# Altium schematic sheet MINIMP3.SchDoc
size A3
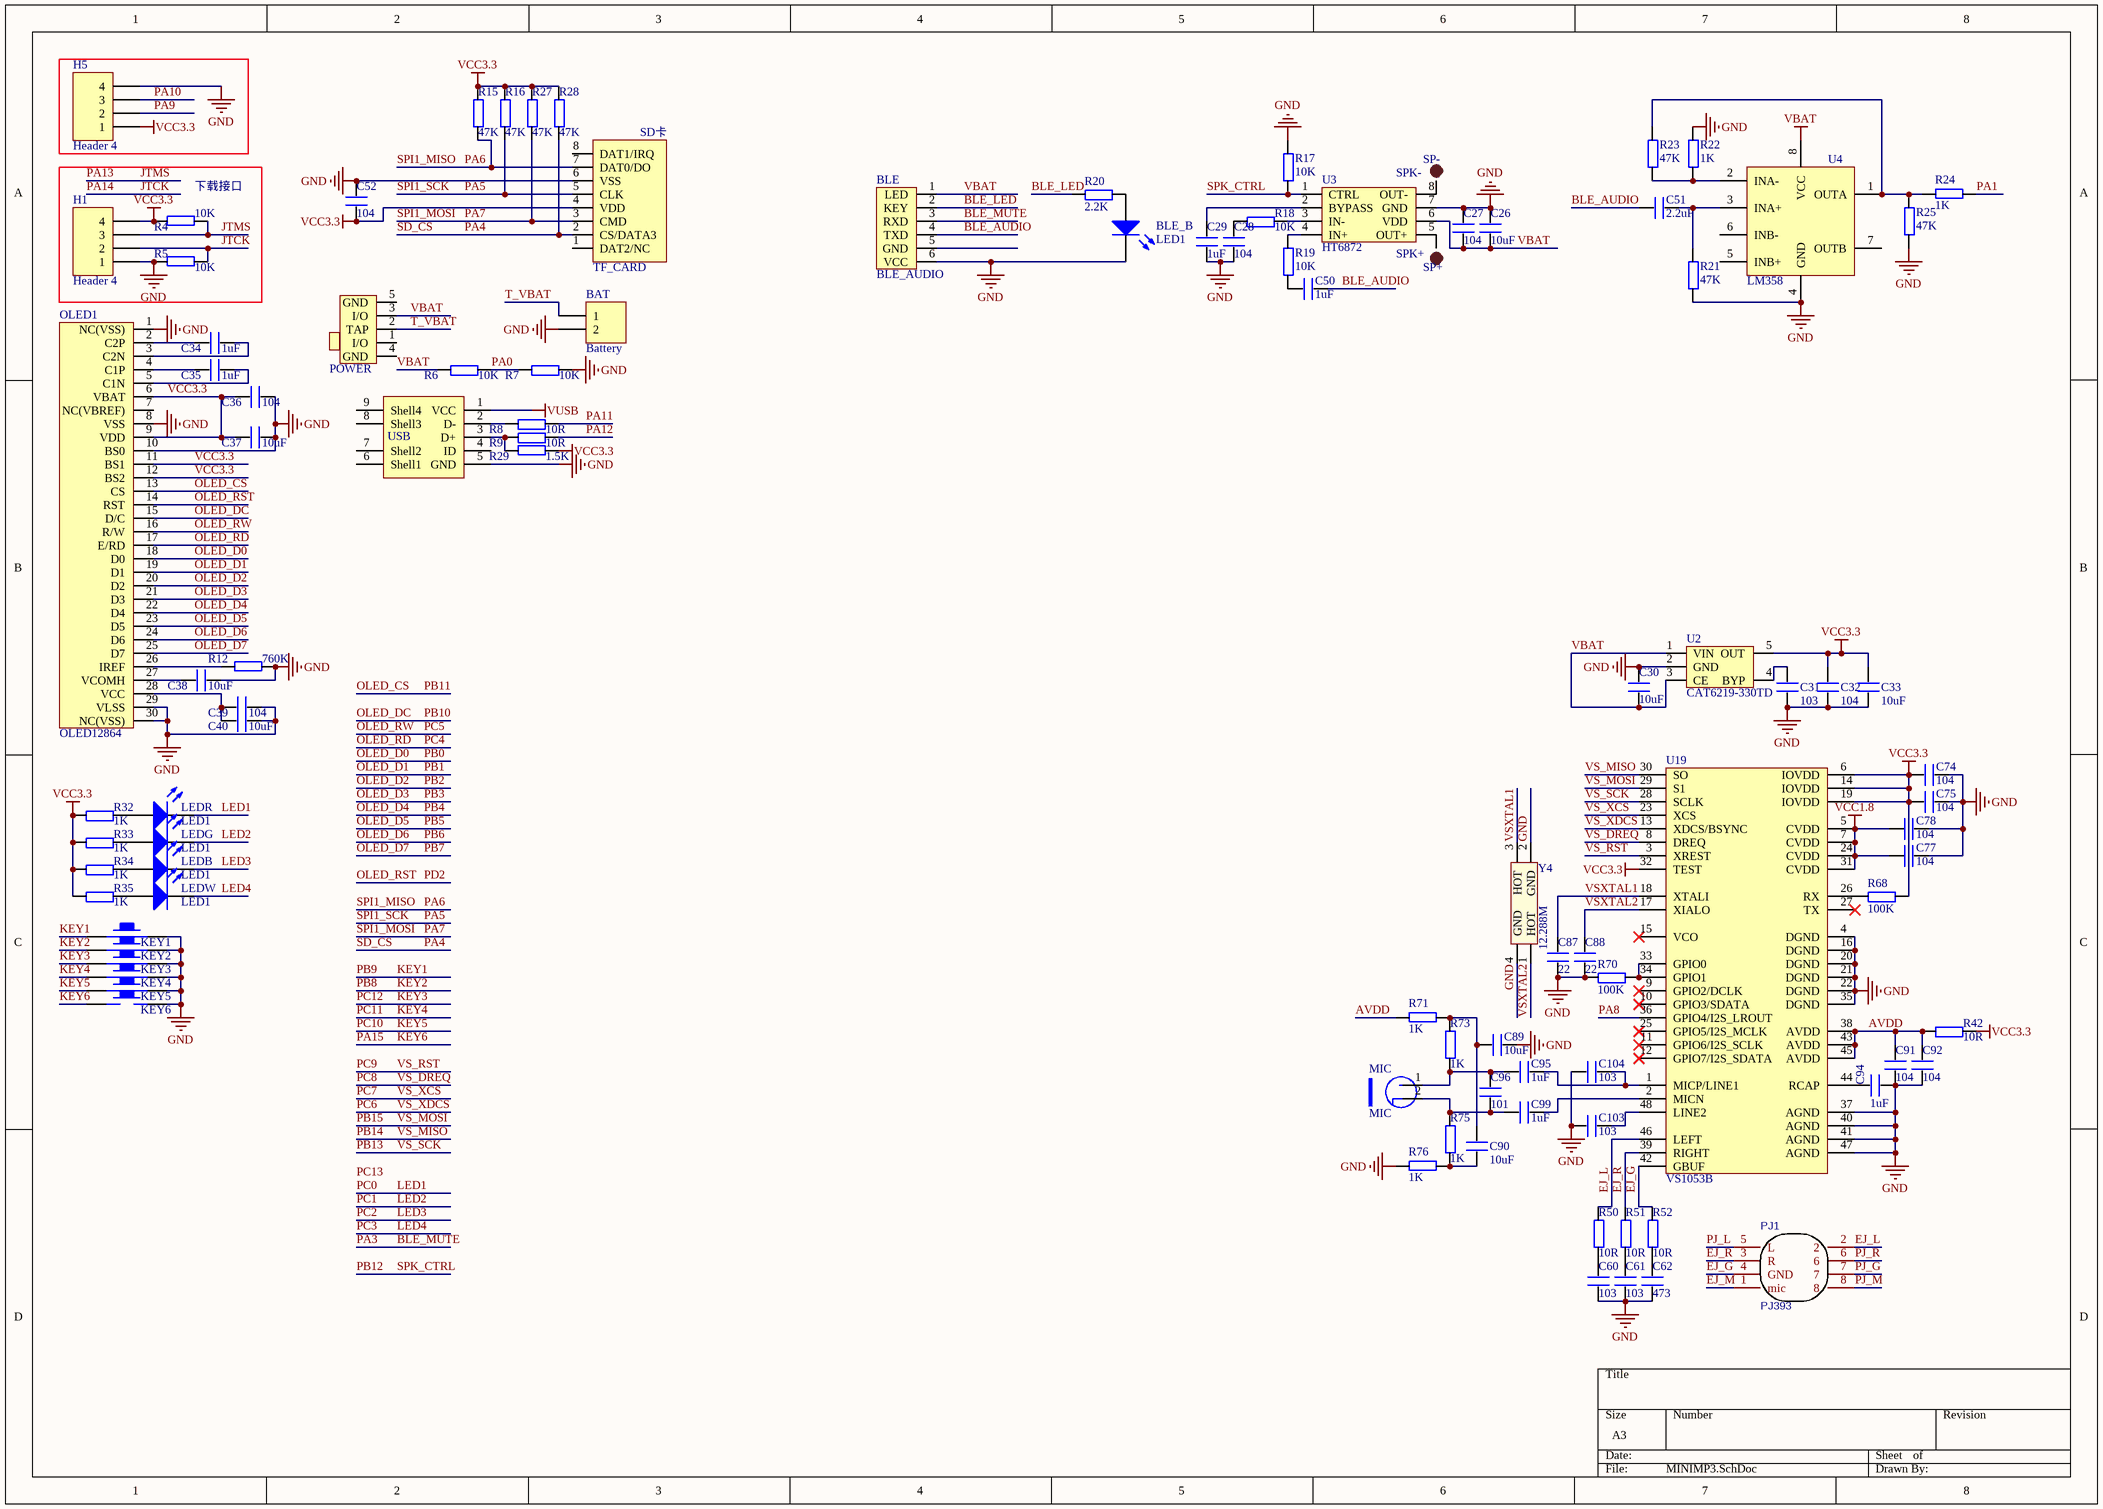
[diagram p0: MINIMP3.SchDoc]

## Parts
BAT  Battery  [HDR2.54-LI-2P]
BLE  BLE_AUDIO  [HEAD6]
BLE_B  LED1  [LED 0805B]
C26  10uF  [C 0603_M]
C27  104  [C 0603_M]
C28  104  [C 0603_M]
C29  1uF  [C 0603_M]
C30  10uF  [C 0603_M]
C31  103  [C 0603_M]
C32  104  [C 0603_M]
C33  10uF  [C 0603_M]
C34  1uF  [C 0603_M]
C35  1uF  [C 0603_M]
C36  104  [C 0603_M]
C37  10uF  [C 0603_M]
C38  10uF  [C 0603_M]
C39  104  [C 0603_M]
C40  10uF  [C 0603_M]
C50  1uF  [C 0603_M]
C51  2.2uF  [C 0603_M]
C52  104  [C 0603_M]
C60  103  [C 0603_M]
C61  103  [C 0603_M]
C62  473  [C 0603_M]
C74  104  [C 0603_M]
C75  104  [C 0603_M]
C77  104  [C 0603_M]
C78  104  [C 0603_M]
C87  22  [C 0603_M]
C88  22  [C 0603_M]
C89  10uF  [C 0805_M]
C90  10uF  [C 0805_M]
C91  104  [C 0603_M]
C92  104  [C 0603_M]
C94  1uF  [C 0603_M]
C95  1uF  [C 0603_M]
C96  101  [C 0603_M]
C99  1uF  [C 0603_M]
C103  103  [C 0603_M]
C104  103  [C 0603_M]
H1  Header 4  [HDR2.54-LI-4P]
H5  Header 4  [HDR2.54-LI-4P]
KEY1  KEY_M  [KEY-SOP324225]  (value not drawn)
KEY2  KEY_M  [KEY-SOP324225]  (value not drawn)
KEY3  KEY_M  [KEY-SOP324225]  (value not drawn)
KEY4  KEY_M  [KEY-SOP324225]  (value not drawn)
KEY5  KEY_M  [KEY-SOP324225]  (value not drawn)
KEY6  KEY_M  [KEY-SOP324225]  (value not drawn)
LEDB  LED1  [LED 0805B]
LEDG  LED1  [LED 0805B]
LEDR  LED1  [LED 0805B]
LEDW  LED1  [LED 0805B]
MIC  MIC  [MIC-6022]
OLED1  OLED12864  [OLED_0.96]
PJ1  PJ393  [PJ393]
POWER  BUTTON_DIP3  [MSK-12C01-07]  (value not drawn)
R4  10K  [R 0603_M]
R5  10K  [R 0603_M]
R6  10K  [R 0603_M]
R7  10K  [R 0603_M]
R8  10R  [R 0603_M]
R9  10R  [R 0603_M]
R12  760K  [R 0603_M]
R15  47K  [R 0603_M]
R16  47K  [R 0603_M]
R17  10K  [R 0603_M]
R18  10K  [R 0603_M]
R19  10K  [R 0603_M]
R20  2.2K  [R 0603_M]
R21  47K  [R 0603_M]
R22  1K  [R 0603_M]
R23  47K  [R 0603_M]
R24  1K  [R 0603_M]
R25  47K  [R 0603_M]
R27  47K  [R 0603_M]
R28  47K  [R 0603_M]
R29  1.5K  [R 0603_M]
R32  1K  [R 0603_M]
R33  1K  [R 0603_M]
R34  1K  [R 0603_M]
R35  1K  [R 0603_M]
R42  10R  [R 0603_M]
R50  10R  [R 0603_M]
R51  10R  [R 0603_M]
R52  10R  [R 0603_M]
R68  100K  [R 0603_M]
R70  100K  [R 0603_M]
R71  1K  [R 0603_M]
R73  1K  [R 0603_M]
R75  1K  [R 0603_M]
R76  1K  [R 0603_M]
SP+  SPK+  [TP-1.5]
SP-  SPK-  [TP-1.5]
TF_CARD  SD-MICRO-TF  [SD-MICRO-TF]  (value not drawn)
U2  CAT6219-330TD  [SOT23-5N]
U3  HT6872  [SOP8_N]
U4  LM358  [SOP8_N]
U19  VS1053B  [LQFP-48N]
USB  J-MICRO-USB-5S  [USB-AB-5S]  (value not drawn)
Y4  12.288M  [OSC 3225-4P]

## Blocks framed on the sheet
下载接口: H1 R4 R5

## Nets
GND: BAT.2 BLE.6(VCC) BLE_B.2(K) C26.2 C27.2 C28.1 C29.1 C30.2 C31.1 C32.1 C33.1 C36.1 C37.1 C38.1 C39.1 C40.1 C52.2 C60.1 C61.1 C62.1 C74.2 C75.1 C77.2 C78.2 C87.1 C88.1 C89.1 C91.1 C92.1 C94.2 C103.2 C104.1 H1.1 H5.4 KEY1.2 KEY2.2 KEY3.2 KEY4.2 KEY5.2 KEY6.2 OLED1.1(NC(VSS)) OLED1.8(VSS) OLED1.10(BS0) OLED1.29(VLSS) OLED1.30(NC(VSS)) R5.2 R7.2 R12.1 R17.2 R21.1 R22.2 R25.1 R70.1 R76.2 TF_CARD.6(VSS) U2.2(GND) U3.7(GND) U4.4(GND) U19.4(DGND) U19.16(DGND) U19.20(DGND) U19.21(DGND) U19.22(DGND) U19.35(DGND) U19.37(AGND) U19.40(AGND) U19.41(AGND) U19.47(AGND) USB.5(GND) Y4.2(GND) Y4.4(GND)
VBAT: BLE.1(LED) C26.1 C27.1 C30.1 POWER.3(I/O) R6.1 U2.1(VIN) U2.3(CE) U3.6(VDD) U4.8(VCC)
VCC1.8: C77.1 C78.1 U19.5(CVDD) U19.7(CVDD) U19.24(CVDD) U19.31(CVDD)
VCC3.3: C32.2 C33.2 C36.2 C37.2 C52.1 C74.1 C75.2 H1.4 H5.1 OLED1.6(VBAT) OLED1.9(VDD) OLED1.11(BS1) OLED1.12(BS2) R4.2 R15.2 R16.2 R27.2 R28.2 R29.1 R32.1 R33.1 R34.1 R35.1 R42.2 R68.2 TF_CARD.4(VDD) U2.5(OUT) U19.6(IOVDD) U19.14(IOVDD) U19.19(IOVDD) U19.32(TEST)
VUSB: USB.1(VCC)
AVDD: C91.2 C92.2 R42.1 R71.2 U19.38(AVDD) U19.43(AVDD) U19.45(AVDD)
BLE_AUDIO: BLE.4(TXD) C50.2 C51.1
BLE_LED: BLE.2(KEY) R20.1
BLE_MUTE: BLE.3(RXD)  [also labelled PA3]
EJ_G: PJ1.4(GND) R52.2 U19.42(GBUF)
EJ_L: PJ1.2 R50.2 U19.46(LEFT)
EJ_M: PJ1.1(mic)
EJ_R: PJ1.3(R) R51.2 U19.39(RIGHT)
JTCK: H1.2 R5.1  [also labelled PA14]
JTMS: H1.3 R4.1  [also labelled PA13]
KEY1: KEY1.1  [also labelled PB9]
KEY2: KEY2.1  [also labelled PB8]
KEY3: KEY3.1  [also labelled PC12]
KEY4: KEY4.1  [also labelled PC11]
KEY5: KEY5.1  [also labelled PC10]
KEY6: KEY6.1  [also labelled PA15]
LED1: LEDR.2(K)  [also labelled PC0]
LED2: LEDG.2(K)  [also labelled PC1]
LED3: LEDB.2(K)  [also labelled PC2]
LED4: LEDW.2(K)  [also labelled PC3]
OLED_CS: OLED1.13(CS)  [also labelled PB11]
OLED_D0: OLED1.18(D0)  [also labelled PB0]
OLED_D1: OLED1.19(D1)  [also labelled PB1]
OLED_D2: OLED1.20(D2)  [also labelled PB2]
OLED_D3: OLED1.21(D3)  [also labelled PB3]
OLED_D4: OLED1.22(D4)  [also labelled PB4]
OLED_D5: OLED1.23(D5)  [also labelled PB5]
OLED_D6: OLED1.24(D6)  [also labelled PB6]
OLED_D7: OLED1.25(D7)  [also labelled PB7]
OLED_DC: OLED1.15(D/C)  [also labelled PB10]
OLED_RD: OLED1.17(E/RD)  [also labelled PC4]
OLED_RST: OLED1.14(RST)  [also labelled PD2]
OLED_RW: OLED1.16(R/W)  [also labelled PC5]
PA0: R6.2 R7.1
PA1: R24.1
PA4: R28.1 TF_CARD.2(CS/DATA3)  [also labelled SD_CS]
PA5: R16.1 TF_CARD.5(CLK)  [also labelled SPI1_SCK]
PA6: R15.1 TF_CARD.7(DAT0/DO)  [also labelled SPI1_MISO]
PA7: R27.1 TF_CARD.3(CMD)  [also labelled SPI1_MOSI]
PA8: U19.36(GPIO4/I2S_LROUT)
PA9: H5.2
PA10: H5.3
PA11: R8.2
PA12: R9.2
PB12: R17.1 U3.1(CTRL)  [also labelled SPK_CTRL]
PB13: U19.28(SCLK)  [also labelled VS_SCK]
PB14: U19.30(SO)  [also labelled VS_MISO]
PB15: U19.29(S1)  [also labelled VS_MOSI]
PC6: U19.13(XDCS/BSYNC)  [also labelled VS_XDCS]
PC7: U19.23(XCS)  [also labelled VS_XCS]
PC8: U19.8(DREQ)  [also labelled VS_DREQ]
PC9: U19.3(XREST)  [also labelled VS_RST]
PJ_G: PJ1.7
PJ_L: PJ1.5(L)
PJ_M: PJ1.8
PJ_R: PJ1.6
T_VBAT: BAT.1 POWER.2(TAP)
VSXTAL1: C87.2 U19.18(XTALI) Y4.3(HOT)
VSXTAL2: C88.2 U19.17(XIALO) Y4.1(HOT)
NetBLE_B_1: BLE_B.1(A) R20.2
NetC28_2: C28.2 R18.1
NetC29_2: C29.2 U3.2(BYPASS)
NetC31_2: C31.2 U2.4(BYP)
NetC34_1: C34.1 OLED1.3(C2N)
NetC34_2: C34.2 OLED1.2(C2P)
NetC35_1: C35.1 OLED1.5(C1N)
NetC35_2: C35.2 OLED1.4(C1P)
NetC38_2: C38.2 OLED1.27(VCOMH)
NetC39_2: C39.2 C40.2 OLED1.28(VCC)
NetC50_1: C50.1 R19.1
NetC51_2: C51.2 R21.2 U4.3(INA+)
NetC60_2: C60.2 R50.1
NetC61_2: C61.2 R51.1
NetC62_2: C62.2 R52.1
NetC89_2: C89.2 C90.2 R71.1 R73.2
NetC90_1: C90.1 R75.1 R76.1
NetC94_1: C94.1 U19.44(RCAP)
NetC95_1: C95.1 C96.2 MIC.1(VCC) R73.1
NetC95_2: C95.2 C104.2 U19.1(MICP/LINE1)
NetC96_1: C96.1 C99.2 MIC.2(GND) R75.2
NetC99_1: C99.1 U19.2(MICN)
NetC103_1: C103.1 U19.48(LINE2)
NetLEDB_1: LEDB.1(A) R34.2
NetLEDG_1: LEDG.1(A) R33.2
NetLEDR_1: LEDR.1(A) R32.2
NetLEDW_1: LEDW.1(A) R35.2
NetOLED1_26: OLED1.26(IREF) R12.2
NetR8_1: R8.1 USB.2(D-)
NetR9_1: R9.1 R29.2 USB.3(D+)
NetR18_2: R18.2 U3.3(IN-)
NetR19_2: R19.2 U3.4(IN+)
NetR22_1: R22.1 R23.1 U4.2(INA-)
NetR23_2: R23.2 R24.2 R25.2 U4.1(OUTA)
NetR68_1: R68.1 U19.26(RX)
NetR70_2: R70.2 U19.33(GPIO0) U19.34(GPIO1)
NetSP+_1: SP+.1 U3.5(OUT+)
NetSP-_1: SP-.1 U3.8(OUT-)

Not connected (* = marked no-connect by the designer): BLE 5(GND); OLED1 7(NC(VBREF)); POWER 1(I/O) 4(GND) 5(GND); TF_CARD 1(DAT2/NC) 8(DAT1/IRQ); U4 5(INB+) 6(INB-) 7(OUTB); U19 9(GPIO2/DCLK)* 10(GPIO3/SDATA)* 11(GPIO6/I2S_SCLK)* 12(GPIO7/I2S_SDATA)* 15(VCO)* 25(GPIO5/I2S_MCLK)* 27(TX)*; USB 4(ID) 6(Shell1) 7(Shell2) 8(Shell3) 9(Shell4)

## Notes on the sheet
- (near TF_CARD) SD卡
- Labels drawn without touching a wire or pin: PC13

## Library data of the parts
BAT = Header 2: Header, 2-Pin; LatestRevisionDate: 17-Jul-2002; LatestRevisionNote: Re-released for DXP Platform.; Publisher: Altium Limited
BLE = ATK-HC05
BLE_B LEDB LEDG LEDR LEDW = LED2: Typical RED, GREEN, YELLOW, AMBER GaAs LED; Published: 8-Jun-2000; LatestRevisionDate: 17-Jul-2002; LatestRevisionNote: Re-released for DXP Platform.; PackageDocument: Feb-2002; PackageReference: 3.2X1.6X1.1; Publisher: Altium Limited
C26-C40 C50-C52 C60-C62 C74 C75 C77 C78 C87-C92 C94-C96 C99 C103 C104 = C
H1 H5 = Header 4: Header, 4-Pin; LatestRevisionDate: 17-Jul-2002; LatestRevisionNote: Re-released for DXP Platform.; Publisher: Altium Limited
PJ1 = PJ393: Contributor: infinite_possibilities; BOM_Manufacturer Part: ?; spicePre: U
POWER = BUTTON_DIP3: 拨动开关SS-12F44
R4-R9 R12 R15-R25 R27-R29 R32-R35 R42 R50-R52 R68 R70 R71 R73 R75 R76 = R
SP+ SP- = TEST-POINT: 测试点
TF_CARD = SD-MICRO-TF: SD,MICRO,TF
U2 = CAT6219-330TD: 3.3V 500mA LDO
U3 = HT6871
U4 = Component_2
U19 = VS1053
USB = J-MICRO-USB-5S: Micro USB 5.9有柱脚长1.25加长针
Y4 = XTAL_3225: 3225贴片无源晶振